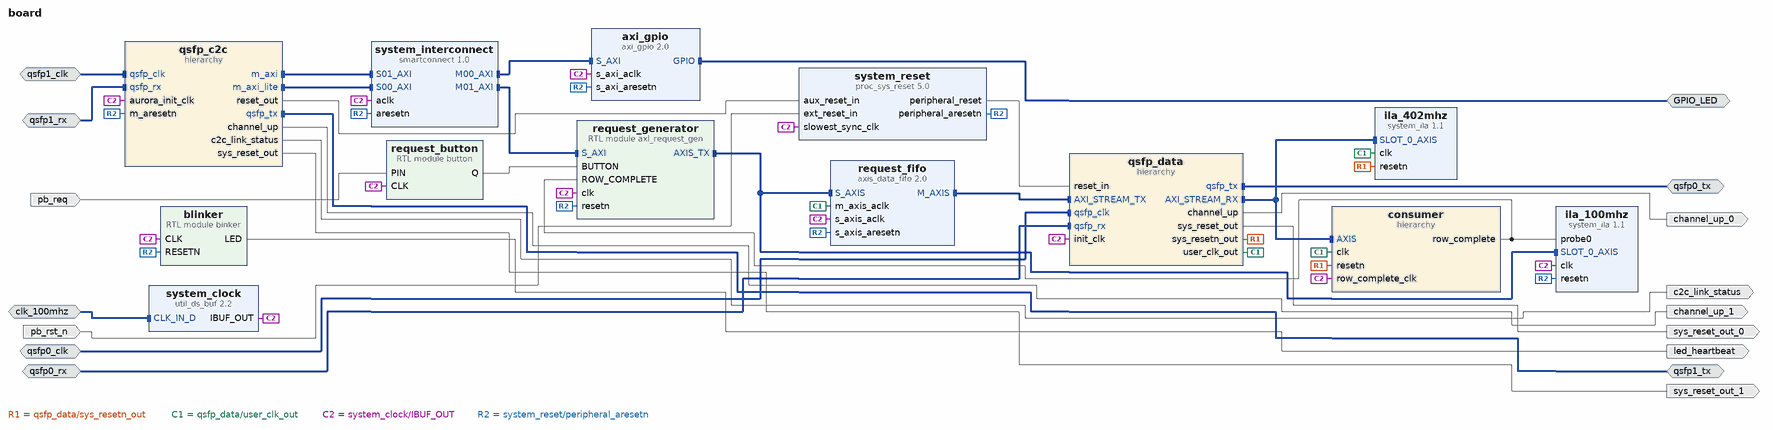
[diagram p0: block diagram of the top level]
# Vivado block design board, xczu19eg-ffvc1760-2-i, Vivado 2021.1
create_bd_design board

create_bd_intf_port -mode Slave -vlnv xilinx.com:interface:diff_clock_rtl:1.0 clk_100mhz
create_bd_intf_port -mode Slave -vlnv xilinx.com:interface:diff_clock_rtl:1.0 qsfp1_clk
set_property -dict {CONFIG.FREQ_HZ 322265625} [get_bd_intf_ports qsfp1_clk]
create_bd_intf_port -mode Slave -vlnv xilinx.com:display_aurora:GT_Serial_Transceiver_Pins_RX_rtl:1.0 qsfp1_rx
create_bd_intf_port -mode Master -vlnv xilinx.com:display_aurora:GT_Serial_Transceiver_Pins_TX_rtl:1.0 qsfp1_tx
create_bd_intf_port -mode Master -vlnv xilinx.com:interface:gpio_rtl:1.0 GPIO_LED
create_bd_intf_port -mode Slave -vlnv xilinx.com:interface:diff_clock_rtl:1.0 qsfp0_clk
set_property -dict {CONFIG.FREQ_HZ 322265625} [get_bd_intf_ports qsfp0_clk]
create_bd_intf_port -mode Master -vlnv xilinx.com:display_aurora:GT_Serial_Transceiver_Pins_TX_rtl:1.0 qsfp0_tx
create_bd_intf_port -mode Slave -vlnv xilinx.com:display_aurora:GT_Serial_Transceiver_Pins_RX_rtl:1.0 qsfp0_rx
create_bd_port -dir O led_heartbeat
create_bd_port -dir I -type rst pb_rst_n
create_bd_port -dir O channel_up_1
create_bd_port -dir O -type rst sys_reset_out_1
set_property -dict {CONFIG.POLARITY ACTIVE_HIGH} [get_bd_ports sys_reset_out_1]
create_bd_port -dir O -type rst sys_reset_out_0
set_property -dict {CONFIG.POLARITY ACTIVE_HIGH} [get_bd_ports sys_reset_out_0]
create_bd_port -dir O channel_up_0
create_bd_port -dir O c2c_link_status
create_bd_port -dir I pb_req

create_bd_cell -type ip -vlnv xilinx.com:ip:util_ds_buf:2.2 system_clock
create_bd_cell -type ip -vlnv xilinx.com:ip:proc_sys_reset:5.0 system_reset
create_bd_cell -type ip -vlnv xilinx.com:ip:smartconnect:1.0 system_interconnect
set_property -dict {CONFIG.NUM_CLKS 1 CONFIG.NUM_MI 2 CONFIG.NUM_SI 2} [get_bd_cells system_interconnect]
create_bd_cell -type ip -vlnv xilinx.com:ip:axi_gpio:2.0 axi_gpio
set_property -dict {CONFIG.C_GPIO_WIDTH 4 CONFIG.GPIO_BOARD_INTERFACE Custom CONFIG.USE_BOARD_FLOW true} [get_bd_cells axi_gpio]
create_bd_cell -type module -reference binker blinker
create_bd_cell -type hier qsfp_c2c
create_bd_cell -type hier qsfp_data
create_bd_cell -type module -reference button request_button
set_property -dict {CONFIG.ACTIVE_STATE 0 CONFIG.CLOCKS_PER_USEC 400} [get_bd_cells request_button]
create_bd_cell -type ip -vlnv xilinx.com:ip:axis_data_fifo:2.0 request_fifo
set_property -dict {CONFIG.FIFO_DEPTH 256 CONFIG.IS_ACLK_ASYNC 1} [get_bd_cells request_fifo]
create_bd_cell -type ip -vlnv xilinx.com:ip:system_ila:1.1 ila_100mhz
set_property -dict [list \
  CONFIG.C_DATA_DEPTH 2048 \
  CONFIG.C_MON_TYPE MIX \
  CONFIG.C_NUM_MONITOR_SLOTS 1 \
  CONFIG.C_SLOT_0_APC_EN 0 \
  CONFIG.C_SLOT_0_AXI_DATA_SEL 1 \
  CONFIG.C_SLOT_0_AXI_TRIG_SEL 1 \
  CONFIG.C_SLOT_0_INTF_TYPE xilinx.com:interface:axis_rtl:1.0 \
] [get_bd_cells ila_100mhz]
create_bd_cell -type hier consumer
create_bd_cell -type module -reference axi_request_gen request_generator
create_bd_cell -type ip -vlnv xilinx.com:ip:system_ila:1.1 ila_402mhz
set_property -dict [list \
  CONFIG.C_MON_TYPE INTERFACE \
  CONFIG.C_NUM_MONITOR_SLOTS 1 \
  CONFIG.C_SLOT_0_APC_EN 0 \
  CONFIG.C_SLOT_0_AXI_DATA_SEL 1 \
  CONFIG.C_SLOT_0_AXI_TRIG_SEL 1 \
  CONFIG.C_SLOT_0_INTF_TYPE xilinx.com:interface:axis_rtl:1.0 \
] [get_bd_cells ila_402mhz]

# ---- hierarchy /qsfp_c2c ----
current_bd_instance /qsfp_c2c
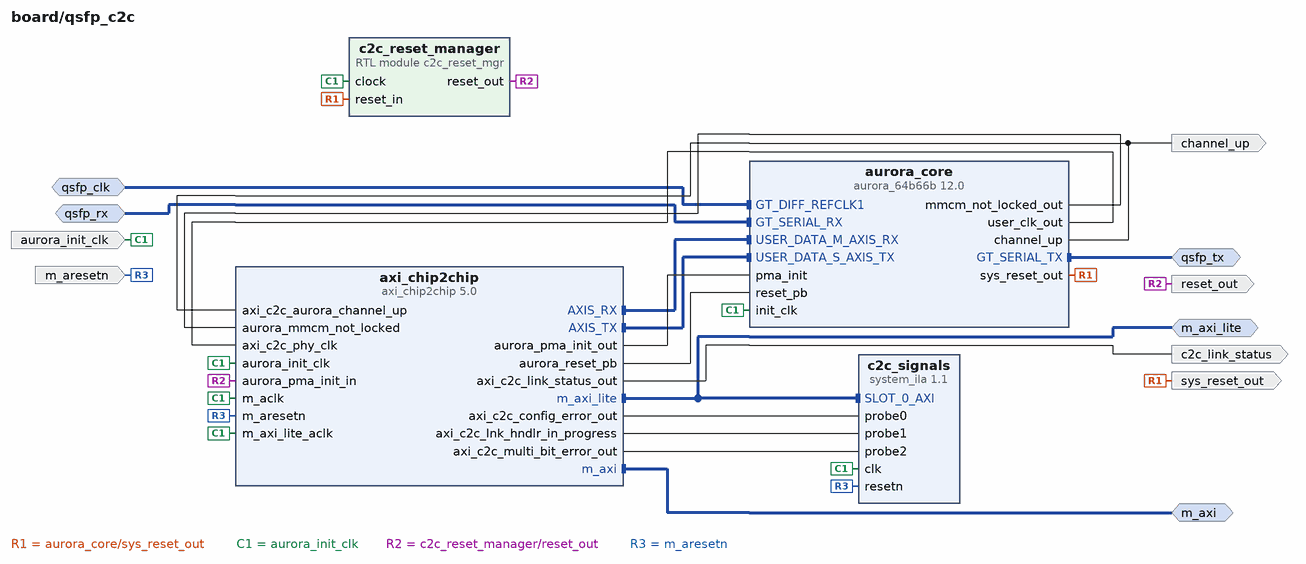
[diagram p1: block diagram inside /qsfp_c2c]
create_bd_intf_pin -mode Master -vlnv xilinx.com:interface:aximm_rtl:1.0 m_axi_lite
create_bd_intf_pin -mode Master -vlnv xilinx.com:interface:aximm_rtl:1.0 m_axi
create_bd_intf_pin -mode Slave -vlnv xilinx.com:interface:diff_clock_rtl:1.0 qsfp_clk
create_bd_intf_pin -mode Slave -vlnv xilinx.com:display_aurora:GT_Serial_Transceiver_Pins_RX_rtl:1.0 qsfp_rx
create_bd_intf_pin -mode Master -vlnv xilinx.com:display_aurora:GT_Serial_Transceiver_Pins_TX_rtl:1.0 qsfp_tx
create_bd_pin -dir I -type clk aurora_init_clk
create_bd_pin -dir O channel_up
create_bd_pin -dir O -type rst sys_reset_out
create_bd_pin -dir O c2c_link_status
create_bd_pin -dir I -type rst m_aresetn
create_bd_pin -dir O -type rst reset_out

create_bd_cell -type ip -vlnv xilinx.com:ip:axi_chip2chip:5.0 axi_chip2chip
set_property -dict [list \
  CONFIG.C_AXI_DATA_WIDTH 32 \
  CONFIG.C_AXI_STB_WIDTH 4 \
  CONFIG.C_EN_AXI_LINK_HNDLR true \
  CONFIG.C_INCLUDE_AXILITE 2 \
  CONFIG.C_INTERFACE_MODE 0 \
  CONFIG.C_INTERFACE_TYPE 2 \
  CONFIG.C_MASTER_FPGA 0 \
  CONFIG.C_M_AXI_ID_WIDTH 0 \
  CONFIG.C_M_AXI_WUSER_WIDTH 0 \
] [get_bd_cells axi_chip2chip]
create_bd_cell -type ip -vlnv xilinx.com:ip:system_ila:1.1 c2c_signals
set_property -dict [list \
  CONFIG.C_MON_TYPE MIX \
  CONFIG.C_NUM_MONITOR_SLOTS 1 \
  CONFIG.C_NUM_OF_PROBES 3 \
  CONFIG.C_PROBE0_TYPE 0 \
  CONFIG.C_PROBE1_TYPE 0 \
  CONFIG.C_PROBE2_TYPE 0 \
  CONFIG.C_PROBE3_TYPE 0 \
  CONFIG.C_PROBE4_TYPE 0 \
  CONFIG.C_SLOT_0_APC_EN 0 \
  CONFIG.C_SLOT_0_AXI_AR_SEL_DATA 1 \
  CONFIG.C_SLOT_0_AXI_AR_SEL_TRIG 1 \
  CONFIG.C_SLOT_0_AXI_AW_SEL_DATA 1 \
  CONFIG.C_SLOT_0_AXI_AW_SEL_TRIG 1 \
  CONFIG.C_SLOT_0_AXI_B_SEL_DATA 1 \
  CONFIG.C_SLOT_0_AXI_B_SEL_TRIG 1 \
  CONFIG.C_SLOT_0_AXI_DATA_SEL 1 \
  CONFIG.C_SLOT_0_AXI_R_SEL_DATA 1 \
  CONFIG.C_SLOT_0_AXI_R_SEL_TRIG 1 \
  CONFIG.C_SLOT_0_AXI_TRIG_SEL 1 \
  CONFIG.C_SLOT_0_AXI_W_SEL_DATA 1 \
  CONFIG.C_SLOT_0_AXI_W_SEL_TRIG 1 \
  CONFIG.C_SLOT_0_INTF_TYPE xilinx.com:interface:aximm_rtl:1.0 \
] [get_bd_cells c2c_signals]
create_bd_cell -type ip -vlnv xilinx.com:ip:aurora_64b66b:12.0 aurora_core
set_property -dict [list \
  CONFIG.CHANNEL_ENABLE X0Y16 \
  CONFIG.C_AURORA_LANES 1 \
  CONFIG.C_GT_CLOCK_1 GTYQ0 \
  CONFIG.C_GT_TYPE GTY \
  CONFIG.C_LINE_RATE 10.3125 \
  CONFIG.C_REFCLK_FREQUENCY 322.265625 \
  CONFIG.C_REFCLK_SOURCE MGTREFCLK0_of_Quad_X0Y4 \
  CONFIG.C_START_LANE X0Y16 \
  CONFIG.C_START_QUAD Quad_X0Y4 \
  CONFIG.C_UCOLUMN_USED left \
  CONFIG.SupportLevel 1 \
  CONFIG.TransceiverControl false \
  CONFIG.drp_mode Disabled \
  CONFIG.interface_mode Streaming \
] [get_bd_cells aurora_core]
create_bd_cell -type module -reference c2c_reset_mgr c2c_reset_manager

# ---- hierarchy /qsfp_data ----
current_bd_instance /qsfp_data
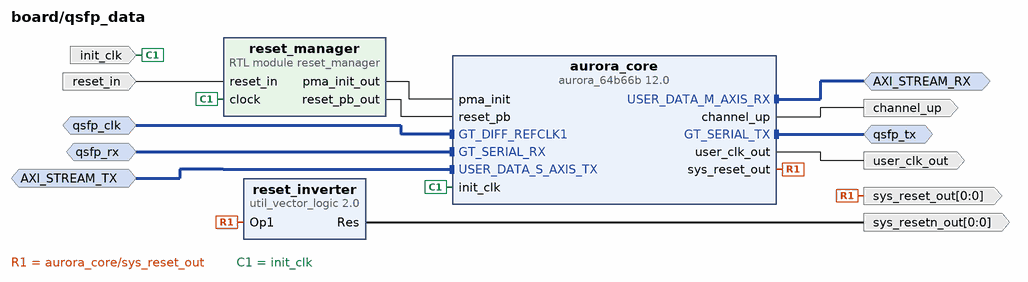
[diagram p2: block diagram inside /qsfp_data]
create_bd_intf_pin -mode Slave -vlnv xilinx.com:interface:axis_rtl:1.0 AXI_STREAM_TX
create_bd_intf_pin -mode Master -vlnv xilinx.com:interface:axis_rtl:1.0 AXI_STREAM_RX
create_bd_intf_pin -mode Slave -vlnv xilinx.com:interface:diff_clock_rtl:1.0 qsfp_clk
create_bd_intf_pin -mode Master -vlnv xilinx.com:display_aurora:GT_Serial_Transceiver_Pins_TX_rtl:1.0 qsfp_tx
create_bd_intf_pin -mode Slave -vlnv xilinx.com:display_aurora:GT_Serial_Transceiver_Pins_RX_rtl:1.0 qsfp_rx
create_bd_pin -dir O channel_up
create_bd_pin -dir I -type clk init_clk
create_bd_pin -dir O -type clk user_clk_out
create_bd_pin -dir O -from 0 -to 0 sys_reset_out
create_bd_pin -dir I -type rst reset_in
create_bd_pin -dir O -from 0 -to 0 sys_resetn_out

create_bd_cell -type ip -vlnv xilinx.com:ip:aurora_64b66b:12.0 aurora_core
set_property -dict [list \
  CONFIG.CHANNEL_ENABLE {X0Y12 X0Y13 X0Y14 X0Y15} \
  CONFIG.C_AURORA_LANES 4 \
  CONFIG.C_GT_CLOCK_1 GTYQ0 \
  CONFIG.C_GT_TYPE GTY \
  CONFIG.C_LINE_RATE 25.78125 \
  CONFIG.C_REFCLK_FREQUENCY 322.265625 \
  CONFIG.C_REFCLK_SOURCE MGTREFCLK0_of_Quad_X0Y3 \
  CONFIG.C_START_LANE X0Y12 \
  CONFIG.C_START_QUAD Quad_X0Y3 \
  CONFIG.C_UCOLUMN_USED left \
  CONFIG.SupportLevel 1 \
  CONFIG.drp_mode Disabled \
  CONFIG.interface_mode Streaming \
] [get_bd_cells aurora_core]
create_bd_cell -type module -reference reset_manager reset_manager
create_bd_cell -type ip -vlnv xilinx.com:ip:util_vector_logic:2.0 reset_inverter
set_property -dict {CONFIG.C_OPERATION not CONFIG.C_SIZE 1} [get_bd_cells reset_inverter]

# ---- hierarchy /consumer ----
current_bd_instance /consumer
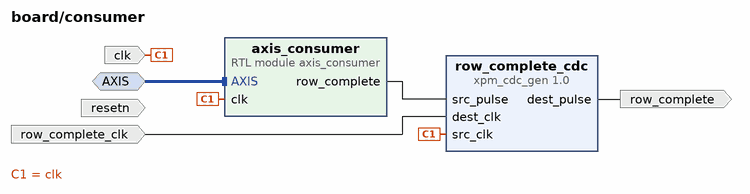
[diagram p3: block diagram inside /consumer]
create_bd_intf_pin -mode Slave -vlnv xilinx.com:interface:axis_rtl:1.0 AXIS
create_bd_pin -dir I -type clk clk
create_bd_pin -dir I -type clk row_complete_clk
create_bd_pin -dir O row_complete
create_bd_pin -dir I -type rst resetn

create_bd_cell -type module -reference axis_consumer axis_consumer
create_bd_cell -type ip -vlnv xilinx.com:ip:xpm_cdc_gen:1.0 row_complete_cdc
set_property -dict [list \
  CONFIG.CDC_TYPE xpm_cdc_pulse \
  CONFIG.RST_USED false \
  CONFIG.SIM_ASSERT_CHK false \
] [get_bd_cells row_complete_cdc]

# ---- connections ----

current_bd_instance /qsfp_c2c
connect_bd_intf_net [get_bd_intf_pins m_axi_lite] [get_bd_intf_pins axi_chip2chip/m_axi_lite]
connect_bd_intf_net [get_bd_intf_pins m_axi_lite] [get_bd_intf_pins c2c_signals/SLOT_0_AXI]
connect_bd_intf_net [get_bd_intf_pins qsfp_clk] [get_bd_intf_pins aurora_core/GT_DIFF_REFCLK1]
connect_bd_intf_net [get_bd_intf_pins qsfp_rx] [get_bd_intf_pins aurora_core/GT_SERIAL_RX]
connect_bd_intf_net [get_bd_intf_pins m_axi] [get_bd_intf_pins axi_chip2chip/m_axi]
connect_bd_intf_net [get_bd_intf_pins qsfp_tx] [get_bd_intf_pins aurora_core/GT_SERIAL_TX]
connect_bd_intf_net [get_bd_intf_pins axi_chip2chip/AXIS_RX] [get_bd_intf_pins aurora_core/USER_DATA_M_AXIS_RX]
connect_bd_intf_net [get_bd_intf_pins axi_chip2chip/AXIS_TX] [get_bd_intf_pins aurora_core/USER_DATA_S_AXIS_TX]
connect_bd_net [get_bd_pins aurora_core/channel_up] [get_bd_pins axi_chip2chip/axi_c2c_aurora_channel_up] [get_bd_pins channel_up]
connect_bd_net [get_bd_pins aurora_core/mmcm_not_locked_out] [get_bd_pins axi_chip2chip/aurora_mmcm_not_locked]
connect_bd_net [get_bd_pins aurora_core/sys_reset_out] [get_bd_pins sys_reset_out] [get_bd_pins c2c_reset_manager/reset_in]
connect_bd_net [get_bd_pins aurora_core/user_clk_out] [get_bd_pins axi_chip2chip/axi_c2c_phy_clk]
connect_bd_net [get_bd_pins aurora_init_clk] \
  [get_bd_pins axi_chip2chip/aurora_init_clk] [get_bd_pins axi_chip2chip/m_axi_lite_aclk] [get_bd_pins axi_chip2chip/m_aclk] \
  [get_bd_pins c2c_signals/clk] [get_bd_pins aurora_core/init_clk] [get_bd_pins c2c_reset_manager/clock]
connect_bd_net [get_bd_pins axi_chip2chip/aurora_pma_init_out] [get_bd_pins aurora_core/pma_init]
connect_bd_net [get_bd_pins axi_chip2chip/aurora_reset_pb] [get_bd_pins aurora_core/reset_pb]
connect_bd_net -net axi_chip2chip_axi_c2c_config_error_out [get_bd_pins axi_chip2chip/axi_c2c_config_error_out] [get_bd_pins c2c_signals/probe0]
connect_bd_net [get_bd_pins axi_chip2chip/axi_c2c_link_status_out] [get_bd_pins c2c_link_status]
connect_bd_net -net axi_chip2chip_axi_c2c_lnk_hndlr_in_progress [get_bd_pins axi_chip2chip/axi_c2c_lnk_hndlr_in_progress] \
  [get_bd_pins c2c_signals/probe1]
connect_bd_net -net axi_chip2chip_axi_c2c_multi_bit_error_out [get_bd_pins axi_chip2chip/axi_c2c_multi_bit_error_out] [get_bd_pins c2c_signals/probe2]
connect_bd_net -net c2c_reset_mgr_0_reset_out [get_bd_pins c2c_reset_manager/reset_out] \
  [get_bd_pins axi_chip2chip/aurora_pma_init_in] [get_bd_pins reset_out]
connect_bd_net [get_bd_pins m_aresetn] [get_bd_pins axi_chip2chip/m_aresetn] [get_bd_pins c2c_signals/resetn]
set_property HDL_ATTRIBUTE.DEBUG true [get_bd_nets axi_chip2chip_axi_c2c_config_error_out]
set_property HDL_ATTRIBUTE.MARK_DEBUG true [get_bd_nets axi_chip2chip_axi_c2c_config_error_out]
set_property HDL_ATTRIBUTE.DEBUG true [get_bd_nets axi_chip2chip_axi_c2c_lnk_hndlr_in_progress]
set_property HDL_ATTRIBUTE.MARK_DEBUG true [get_bd_nets axi_chip2chip_axi_c2c_lnk_hndlr_in_progress]
set_property HDL_ATTRIBUTE.DEBUG true [get_bd_nets axi_chip2chip_axi_c2c_multi_bit_error_out]
set_property HDL_ATTRIBUTE.MARK_DEBUG true [get_bd_nets axi_chip2chip_axi_c2c_multi_bit_error_out]

current_bd_instance /qsfp_data
connect_bd_intf_net [get_bd_intf_pins qsfp_clk] [get_bd_intf_pins aurora_core/GT_DIFF_REFCLK1]
connect_bd_intf_net [get_bd_intf_pins qsfp_rx] [get_bd_intf_pins aurora_core/GT_SERIAL_RX]
connect_bd_intf_net [get_bd_intf_pins qsfp_tx] [get_bd_intf_pins aurora_core/GT_SERIAL_TX]
connect_bd_intf_net [get_bd_intf_pins AXI_STREAM_RX] [get_bd_intf_pins aurora_core/USER_DATA_M_AXIS_RX]
connect_bd_intf_net [get_bd_intf_pins AXI_STREAM_TX] [get_bd_intf_pins aurora_core/USER_DATA_S_AXIS_TX]
connect_bd_net [get_bd_pins aurora_core/channel_up] [get_bd_pins channel_up]
connect_bd_net [get_bd_pins aurora_core/sys_reset_out] [get_bd_pins sys_reset_out] [get_bd_pins reset_inverter/Op1]
connect_bd_net [get_bd_pins aurora_core/user_clk_out] [get_bd_pins user_clk_out]
connect_bd_net [get_bd_pins reset_in] [get_bd_pins reset_manager/reset_in]
connect_bd_net [get_bd_pins reset_inverter/Res] [get_bd_pins sys_resetn_out]
connect_bd_net -net reset_manager_0_pma_init_out [get_bd_pins reset_manager/pma_init_out] [get_bd_pins aurora_core/pma_init]
connect_bd_net -net reset_manager_0_reset_pb_out [get_bd_pins reset_manager/reset_pb_out] [get_bd_pins aurora_core/reset_pb]
connect_bd_net -net system_clock_IBUF_OUT [get_bd_pins init_clk] [get_bd_pins aurora_core/init_clk] [get_bd_pins reset_manager/clock]

current_bd_instance /consumer
connect_bd_intf_net [get_bd_intf_pins AXIS] [get_bd_intf_pins axis_consumer/AXIS]
connect_bd_net -net dest_clk_1 [get_bd_pins row_complete_clk] [get_bd_pins row_complete_cdc/dest_clk]
connect_bd_net -net qsfp_data_user_clk_out [get_bd_pins clk] [get_bd_pins axis_consumer/clk] [get_bd_pins row_complete_cdc/src_clk]
# net resetn_1 has one end: resetn
connect_bd_net -net row_complete [get_bd_pins axis_consumer/row_complete] [get_bd_pins row_complete_cdc/src_pulse]
connect_bd_net [get_bd_pins row_complete_cdc/dest_pulse] [get_bd_pins row_complete]

current_bd_instance /
connect_bd_intf_net [get_bd_intf_ports clk_100mhz] [get_bd_intf_pins system_clock/CLK_IN_D]
connect_bd_intf_net [get_bd_intf_ports qsfp0_clk] [get_bd_intf_pins qsfp_data/qsfp_clk]
connect_bd_intf_net [get_bd_intf_ports qsfp0_rx] [get_bd_intf_pins qsfp_data/qsfp_rx]
connect_bd_intf_net [get_bd_intf_ports qsfp0_tx] [get_bd_intf_pins qsfp_data/qsfp_tx]
connect_bd_intf_net [get_bd_intf_ports GPIO_LED] [get_bd_intf_pins axi_gpio/GPIO]
connect_bd_intf_net [get_bd_intf_pins request_fifo/M_AXIS] [get_bd_intf_pins qsfp_data/AXI_STREAM_TX]
connect_bd_intf_net [get_bd_intf_ports qsfp1_clk] [get_bd_intf_pins qsfp_c2c/qsfp_clk]
connect_bd_intf_net [get_bd_intf_ports qsfp1_rx] [get_bd_intf_pins qsfp_c2c/qsfp_rx]
connect_bd_intf_net [get_bd_intf_pins system_interconnect/S01_AXI] [get_bd_intf_pins qsfp_c2c/m_axi]
connect_bd_intf_net [get_bd_intf_pins qsfp_c2c/m_axi_lite] [get_bd_intf_pins system_interconnect/S00_AXI]
connect_bd_intf_net [get_bd_intf_ports qsfp1_tx] [get_bd_intf_pins qsfp_c2c/qsfp_tx]
connect_bd_intf_net [get_bd_intf_pins qsfp_data/AXI_STREAM_RX] [get_bd_intf_pins consumer/AXIS]
connect_bd_intf_net [get_bd_intf_pins qsfp_data/AXI_STREAM_RX] [get_bd_intf_pins ila_402mhz/SLOT_0_AXIS]
connect_bd_intf_net [get_bd_intf_pins request_generator/AXIS_TX] [get_bd_intf_pins request_fifo/S_AXIS]
connect_bd_intf_net [get_bd_intf_pins request_generator/AXIS_TX] [get_bd_intf_pins ila_100mhz/SLOT_0_AXIS]
connect_bd_intf_net [get_bd_intf_pins axi_gpio/S_AXI] [get_bd_intf_pins system_interconnect/M00_AXI]
connect_bd_intf_net [get_bd_intf_pins system_interconnect/M01_AXI] [get_bd_intf_pins request_generator/S_AXI]
connect_bd_net -net PIN_0_1 [get_bd_ports pb_req] [get_bd_pins request_button/PIN]
connect_bd_net -net aurora_core_channel_up [get_bd_pins qsfp_c2c/channel_up] [get_bd_ports channel_up_1]
connect_bd_net -net aurora_core_channel_up1 [get_bd_pins qsfp_data/channel_up] [get_bd_ports channel_up_0]
connect_bd_net -net aurora_core_sys_reset_out [get_bd_pins qsfp_data/sys_reset_out] [get_bd_ports sys_reset_out_0]
# net axi_c2c_link_error_out has one end: 
connect_bd_net -net binker_0_LED [get_bd_pins blinker/LED] [get_bd_ports led_heartbeat]
connect_bd_net -net ext_reset_in_0_1 [get_bd_ports pb_rst_n] [get_bd_pins system_reset/ext_reset_in]
# net gt_reset_out has one end: 
connect_bd_net -net qsfp_c2c_axi_c2c_link_status_out_0 [get_bd_pins qsfp_c2c/c2c_link_status] [get_bd_ports c2c_link_status]
connect_bd_net [get_bd_pins qsfp_c2c/reset_out] [get_bd_pins system_reset/aux_reset_in]
connect_bd_net [get_bd_pins qsfp_c2c/sys_reset_out] [get_bd_ports sys_reset_out_1]
connect_bd_net [get_bd_pins qsfp_data/sys_resetn_out] [get_bd_pins consumer/resetn] [get_bd_pins ila_402mhz/resetn]
connect_bd_net [get_bd_pins qsfp_data/user_clk_out] [get_bd_pins request_fifo/m_axis_aclk] [get_bd_pins consumer/clk] [get_bd_pins ila_402mhz/clk]
connect_bd_net [get_bd_pins request_button/Q] [get_bd_pins request_generator/BUTTON]
connect_bd_net -net row_complete_cdc_dest_pulse [get_bd_pins consumer/row_complete] \
  [get_bd_pins ila_100mhz/probe0] [get_bd_pins request_generator/ROW_COMPLETE]
connect_bd_net [get_bd_pins system_clock/IBUF_OUT] \
  [get_bd_pins system_reset/slowest_sync_clk] [get_bd_pins system_interconnect/aclk] [get_bd_pins axi_gpio/s_axi_aclk] \
  [get_bd_pins blinker/CLK] [get_bd_pins qsfp_c2c/aurora_init_clk] [get_bd_pins qsfp_data/init_clk] \
  [get_bd_pins request_fifo/s_axis_aclk] [get_bd_pins ila_100mhz/clk] [get_bd_pins request_button/CLK] \
  [get_bd_pins consumer/row_complete_clk] [get_bd_pins request_generator/clk]
connect_bd_net [get_bd_pins system_reset/peripheral_aresetn] \
  [get_bd_pins system_interconnect/aresetn] [get_bd_pins axi_gpio/s_axi_aresetn] [get_bd_pins blinker/RESETN] \
  [get_bd_pins qsfp_c2c/m_aresetn] [get_bd_pins request_fifo/s_axis_aresetn] [get_bd_pins ila_100mhz/resetn] \
  [get_bd_pins request_generator/resetn]
connect_bd_net [get_bd_pins system_reset/peripheral_reset] [get_bd_pins qsfp_data/reset_in]
set_property HDL_ATTRIBUTE.DEBUG true [get_bd_nets axi_c2c_link_error_out]
set_property HDL_ATTRIBUTE.MARK_DEBUG true [get_bd_nets axi_c2c_link_error_out]
set_property HDL_ATTRIBUTE.DEBUG true [get_bd_nets gt_reset_out]
set_property HDL_ATTRIBUTE.MARK_DEBUG true [get_bd_nets gt_reset_out]

# ---- address map ----
assign_bd_address -offset 0x00001000 -range 256 -target_address_space [get_bd_addr_spaces qsfp_c2c/axi_chip2chip/MAXI] [get_bd_addr_segs axi_gpio/S_AXI/Reg]
assign_bd_address -offset 0x00001100 -range 256 -target_address_space [get_bd_addr_spaces qsfp_c2c/axi_chip2chip/MAXI] [get_bd_addr_segs request_generator/S_AXI/reg0]
assign_bd_address -offset 0x00001000 -range 256 -target_address_space [get_bd_addr_spaces qsfp_c2c/axi_chip2chip/MAXI-Lite] [get_bd_addr_segs axi_gpio/S_AXI/Reg]
assign_bd_address -offset 0x00001100 -range 256 -target_address_space [get_bd_addr_spaces qsfp_c2c/axi_chip2chip/MAXI-Lite] [get_bd_addr_segs request_generator/S_AXI/reg0]

validate_bd_design
save_bd_design
